# Altium schematic sheet 1GB DDR3L Modules.SchDoc
size A3; SheetNumber: 8; SheetTotal: 11
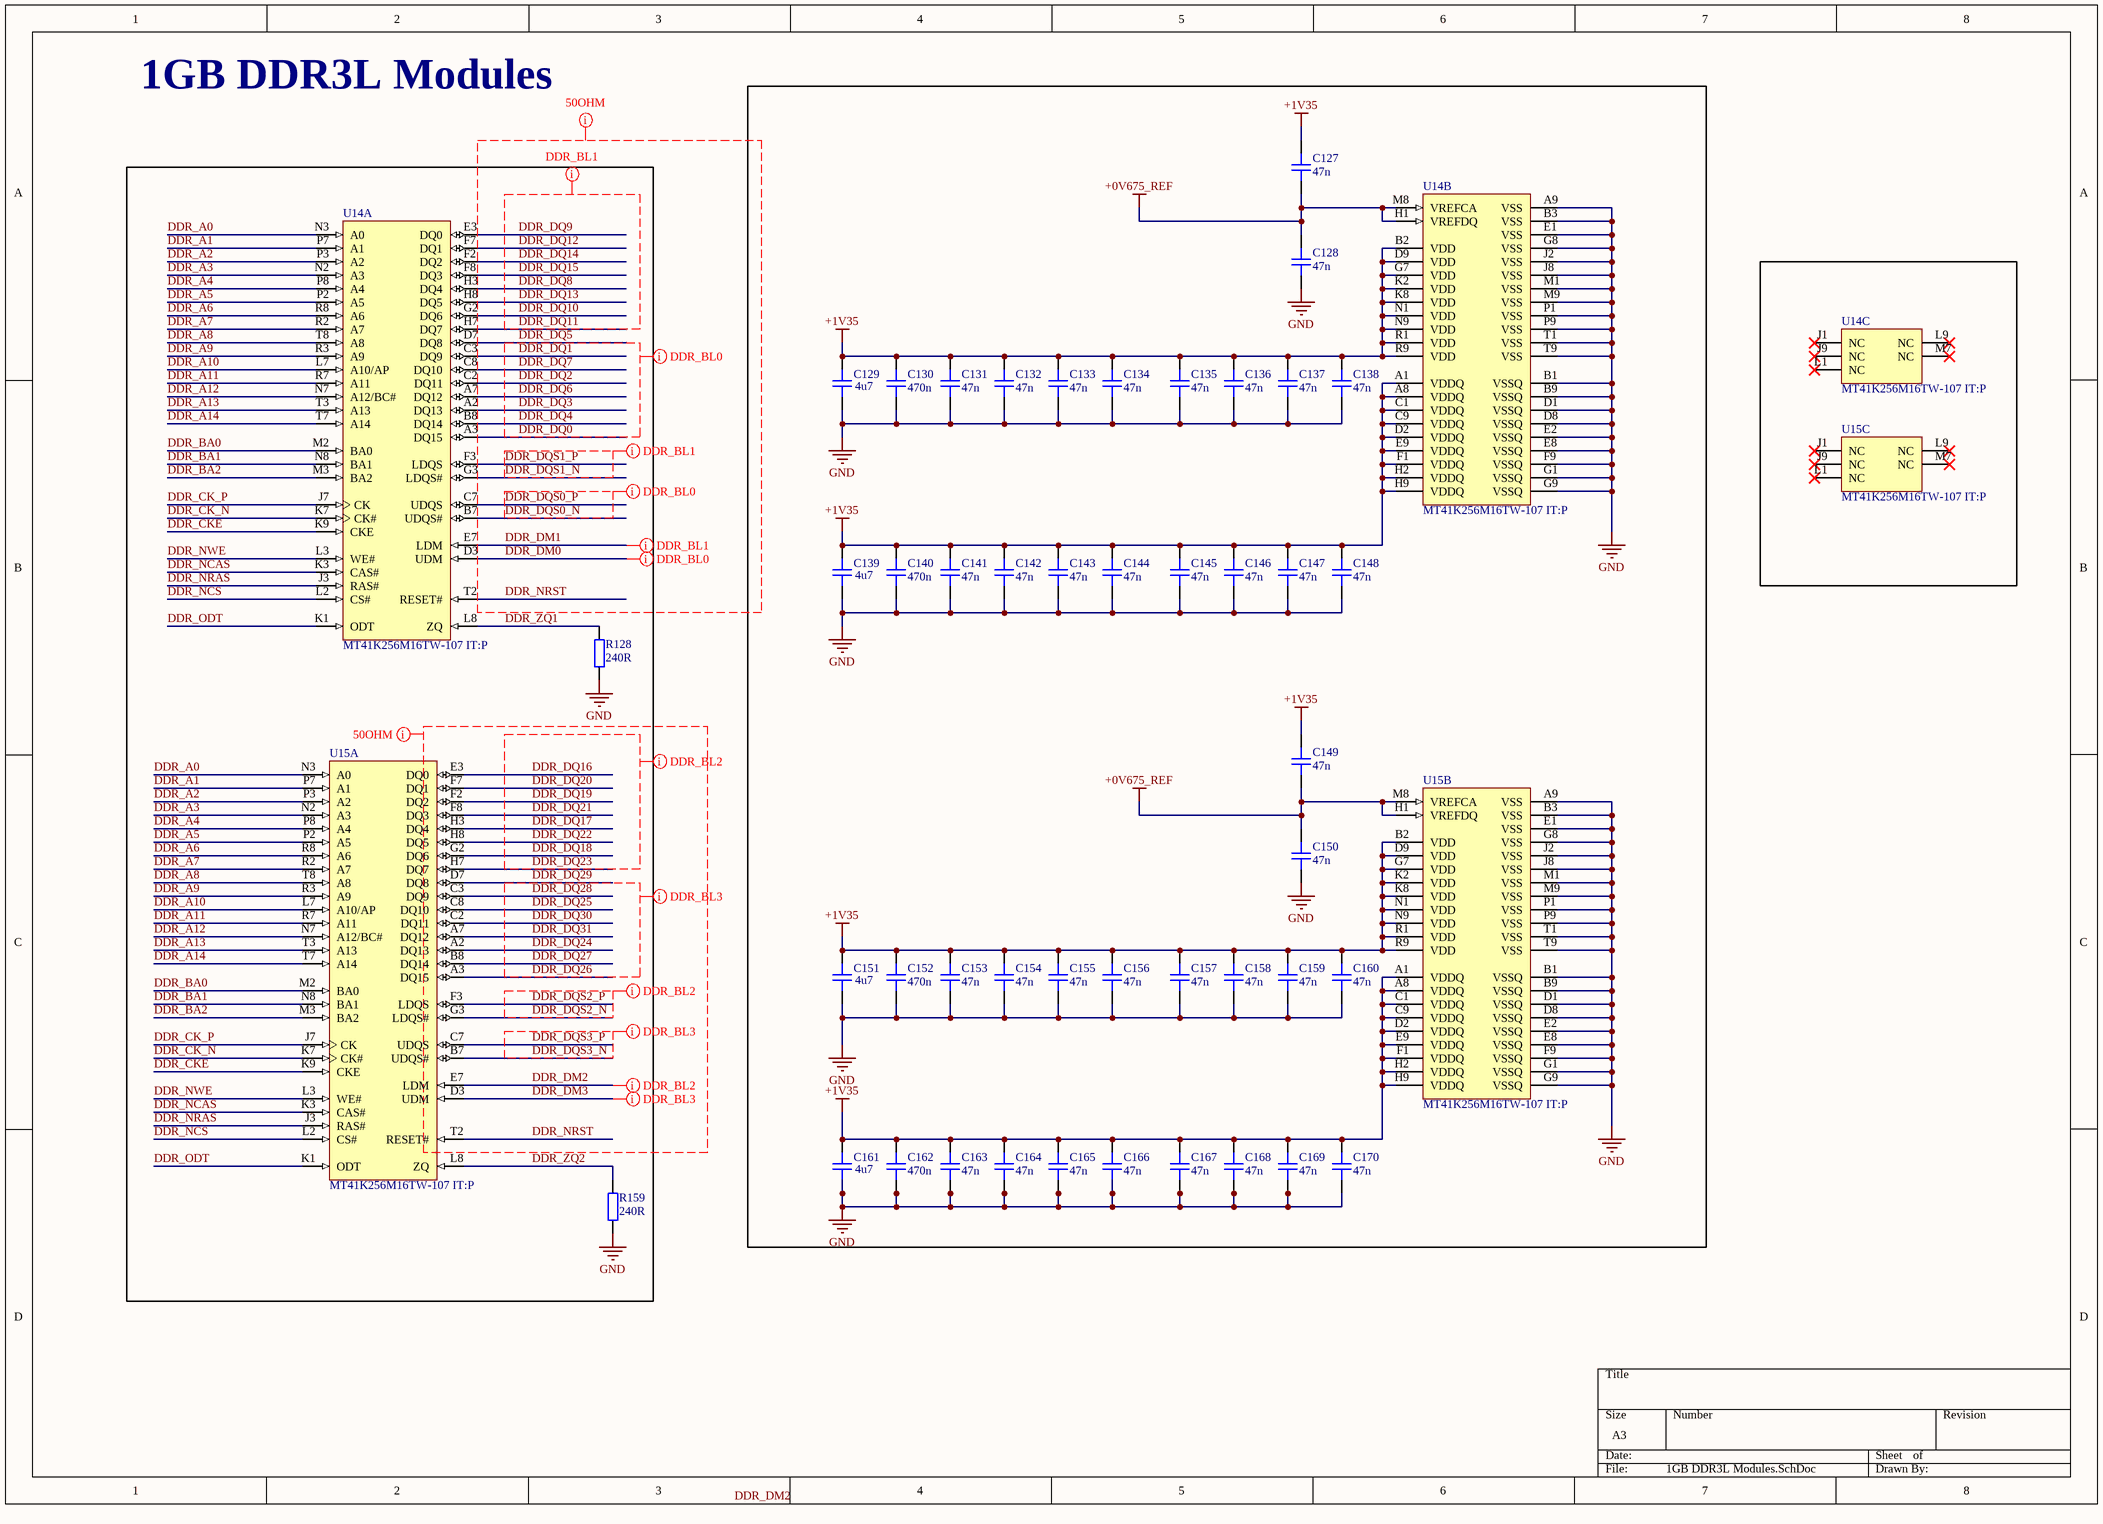
[diagram p0: 1GB DDR3L Modules.SchDoc]

## Parts
C127  value 47n  [CAP_0201]  (hidden comment: C0201)
C128  value 47n  [CAP_0201]  (hidden comment: C0201)
C129  value 4u7  [CAP_0402]  (hidden comment: C0402)
C130  value 470n  [CAP_0201]  (hidden comment: C0201)
C131  value 47n  [CAP_0201]  (hidden comment: C0201)
C132  value 47n  [CAP_0201]  (hidden comment: C0201)
C133  value 47n  [CAP_0201]  (hidden comment: C0201)
C134  value 47n  [CAP_0201]  (hidden comment: C0201)
C135  value 47n  [CAP_0201]  (hidden comment: C0201)
C136  value 47n  [CAP_0201]  (hidden comment: C0201)
C137  value 47n  [CAP_0201]  (hidden comment: C0201)
C138  value 47n  [CAP_0201]  (hidden comment: C0201)
C139  value 4u7  [CAP_0402]  (hidden comment: C0402)
C140  value 470n  [CAP_0201]  (hidden comment: C0201)
C141  value 47n  [CAP_0201]  (hidden comment: C0201)
C142  value 47n  [CAP_0201]  (hidden comment: C0201)
C143  value 47n  [CAP_0201]  (hidden comment: C0201)
C144  value 47n  [CAP_0201]  (hidden comment: C0201)
C145  value 47n  [CAP_0201]  (hidden comment: C0201)
C146  value 47n  [CAP_0201]  (hidden comment: C0201)
C147  value 47n  [CAP_0201]  (hidden comment: C0201)
C148  value 47n  [CAP_0201]  (hidden comment: C0201)
C149  value 47n  [CAP_0201]  (hidden comment: C0201)
C150  value 47n  [CAP_0201]  (hidden comment: C0201)
C151  value 4u7  [CAP_0402]  (hidden comment: C0402)
C152  value 470n  [CAP_0201]  (hidden comment: C0201)
C153  value 47n  [CAP_0201]  (hidden comment: C0201)
C154  value 47n  [CAP_0201]  (hidden comment: C0201)
C155  value 47n  [CAP_0201]  (hidden comment: C0201)
C156  value 47n  [CAP_0201]  (hidden comment: C0201)
C157  value 47n  [CAP_0201]  (hidden comment: C0201)
C158  value 47n  [CAP_0201]  (hidden comment: C0201)
C159  value 47n  [CAP_0201]  (hidden comment: C0201)
C160  value 47n  [CAP_0201]  (hidden comment: C0201)
C161  value 4u7  [CAP_0402]  (hidden comment: C0402)
C162  value 470n  [CAP_0201]  (hidden comment: C0201)
C163  value 47n  [CAP_0201]  (hidden comment: C0201)
C164  value 47n  [CAP_0201]  (hidden comment: C0201)
C165  value 47n  [CAP_0201]  (hidden comment: C0201)
C166  value 47n  [CAP_0201]  (hidden comment: C0201)
C167  value 47n  [CAP_0201]  (hidden comment: C0201)
C168  value 47n  [CAP_0201]  (hidden comment: C0201)
C169  value 47n  [CAP_0201]  (hidden comment: C0201)
C170  value 47n  [CAP_0201]  (hidden comment: C0201)
R128  value 240R  [RES_0402]  (hidden comment: R0402)
R159  value 240R  [RES_0402]  (hidden comment: R0402)
U14  MT41K256M16TW-107 IT:P  [MICT-TW-96]  (parts A,B,C of 3)
U15  MT41K256M16TW-107 IT:P  [MICT-TW-96]  (parts A,B,C of 3)

## Nets
+0V675_REF: C127.1 C128.2 C149.1 C150.2 U14.H1(VREFDQ) U14.M8(VREFCA) U15.H1(VREFDQ) U15.M8(VREFCA)
+1V35: C127.2 C129.2 C130.2 C131.2 C132.2 C133.2 C134.2 C135.2 C136.2 C137.2 C138.2 C139.2 C140.2 C141.2 C142.2 C143.2 C144.2 C145.2 C146.2 C147.2 C148.2 C149.2 C151.2 C152.2 C153.2 C154.2 C155.2 C156.2 C157.2 C158.2 C159.2 C160.2 C161.2 C162.2 C163.2 C164.2 C165.2 C166.2 C167.2 C168.2 C169.2 C170.2 U14.A1(VDDQ) U14.A8(VDDQ) U14.B2(VDD) U14.C1(VDDQ) U14.C9(VDDQ) U14.D2(VDDQ) U14.D9(VDD) U14.E9(VDDQ) U14.F1(VDDQ) U14.G7(VDD) U14.H2(VDDQ) U14.H9(VDDQ) U14.K2(VDD) U14.K8(VDD) U14.N1(VDD) U14.N9(VDD) U14.R1(VDD) U14.R9(VDD) U15.A1(VDDQ) U15.A8(VDDQ) U15.B2(VDD) U15.C1(VDDQ) U15.C9(VDDQ) U15.D2(VDDQ) U15.D9(VDD) U15.E9(VDDQ) U15.F1(VDDQ) U15.G7(VDD) U15.H2(VDDQ) U15.H9(VDDQ) U15.K2(VDD) U15.K8(VDD) U15.N1(VDD) U15.N9(VDD) U15.R1(VDD) U15.R9(VDD)
GND: C128.1 C129.1 C130.1 C131.1 C132.1 C133.1 C134.1 C135.1 C136.1 C137.1 C138.1 C139.1 C140.1 C141.1 C142.1 C143.1 C144.1 C145.1 C146.1 C147.1 C148.1 C150.1 C151.1 C152.1 C153.1 C154.1 C155.1 C156.1 C157.1 C158.1 C159.1 C160.1 C161.1 C162.1 C163.1 C164.1 C165.1 C166.1 C167.1 C168.1 C169.1 C170.1 R128.2 R159.2 U14.A9(VSS) U14.B1(VSSQ) U14.B3(VSS) U14.B9(VSSQ) U14.D1(VSSQ) U14.D8(VSSQ) U14.E1(VSS) U14.E2(VSSQ) U14.E8(VSSQ) U14.F9(VSSQ) U14.G1(VSSQ) U14.G8(VSS) U14.G9(VSSQ) U14.J2(VSS) U14.J8(VSS) U14.M1(VSS) U14.M9(VSS) U14.P1(VSS) U14.P9(VSS) U14.T1(VSS) U14.T9(VSS) U15.A9(VSS) U15.B1(VSSQ) U15.B3(VSS) U15.B9(VSSQ) U15.D1(VSSQ) U15.D8(VSSQ) U15.E1(VSS) U15.E2(VSSQ) U15.E8(VSSQ) U15.F9(VSSQ) U15.G1(VSSQ) U15.G8(VSS) U15.G9(VSSQ) U15.J2(VSS) U15.J8(VSS) U15.M1(VSS) U15.M9(VSS) U15.P1(VSS) U15.P9(VSS) U15.T1(VSS) U15.T9(VSS)
DDR_A0: U14.N3(A0) U15.N3(A0)
DDR_A1: U14.P7(A1) U15.P7(A1)
DDR_A2: U14.P3(A2) U15.P3(A2)
DDR_A3: U14.N2(A3) U15.N2(A3)
DDR_A4: U14.P8(A4) U15.P8(A4)
DDR_A5: U14.P2(A5) U15.P2(A5)
DDR_A6: U14.R8(A6) U15.R8(A6)
DDR_A7: U14.R2(A7) U15.R2(A7)
DDR_A8: U14.T8(A8) U15.T8(A8)
DDR_A9: U14.R3(A9) U15.R3(A9)
DDR_A10: U14.L7(A10/AP) U15.L7(A10/AP)
DDR_A11: U14.R7(A11) U15.R7(A11)
DDR_A12: U14.N7(A12/BC#) U15.N7(A12/BC#)
DDR_A13: U14.T3(A13) U15.T3(A13)
DDR_A14: U14.T7(A14) U15.T7(A14)
DDR_BA0: U14.M2(BA0) U15.M2(BA0)
DDR_BA1: U14.N8(BA1) U15.N8(BA1)
DDR_BA2: U14.M3(BA2) U15.M3(BA2)
DDR_CK_N: U14.K7(CK#) U15.K7(CK#)
DDR_CK_P: U14.J7(CK) U15.J7(CK)
DDR_CKE: U14.K9(CKE) U15.K9(CKE)
DDR_DM0: U14.D3(UDM)
DDR_DM1: U14.E7(LDM)
DDR_DM2: U15.E7(LDM)
DDR_DM3: U15.D3(UDM)
DDR_DQ0: U14.A3(DQ15)
DDR_DQ1: U14.C3(DQ9)
DDR_DQ2: U14.C2(DQ11)
DDR_DQ3: U14.A2(DQ13)
DDR_DQ4: U14.B8(DQ14)
DDR_DQ5: U14.D7(DQ8)
DDR_DQ6: U14.A7(DQ12)
DDR_DQ7: U14.C8(DQ10)
DDR_DQ8: U14.H3(DQ4)
DDR_DQ9: U14.E3(DQ0)
DDR_DQ10: U14.G2(DQ6)
DDR_DQ11: U14.H7(DQ7)
DDR_DQ12: U14.F7(DQ1)
DDR_DQ13: U14.H8(DQ5)
DDR_DQ14: U14.F2(DQ2)
DDR_DQ15: U14.F8(DQ3)
DDR_DQ16: U15.E3(DQ0)
DDR_DQ17: U15.H3(DQ4)
DDR_DQ18: U15.G2(DQ6)
DDR_DQ19: U15.F2(DQ2)
DDR_DQ20: U15.F7(DQ1)
DDR_DQ21: U15.F8(DQ3)
DDR_DQ22: U15.H8(DQ5)
DDR_DQ23: U15.H7(DQ7)
DDR_DQ24: U15.A2(DQ13)
DDR_DQ25: U15.C8(DQ10)
DDR_DQ26: U15.A3(DQ15)
DDR_DQ27: U15.B8(DQ14)
DDR_DQ28: U15.C3(DQ9)
DDR_DQ29: U15.D7(DQ8)
DDR_DQ30: U15.C2(DQ11)
DDR_DQ31: U15.A7(DQ12)
DDR_DQS0_N: U14.B7(UDQS#)
DDR_DQS0_P: U14.C7(UDQS)
DDR_DQS1_N: U14.G3(LDQS#)
DDR_DQS1_P: U14.F3(LDQS)
DDR_DQS2_N: U15.G3(LDQS#)
DDR_DQS2_P: U15.F3(LDQS)
DDR_DQS3_N: U15.B7(UDQS#)
DDR_DQS3_P: U15.C7(UDQS)
DDR_NCAS: U14.K3(CAS#) U15.K3(CAS#)
DDR_NCS: U14.L2(CS#) U15.L2(CS#)
DDR_NRAS: U14.J3(RAS#) U15.J3(RAS#)
DDR_NRST: U14.T2(RESET#) U15.T2(RESET#)
DDR_NWE: U14.L3(WE#) U15.L3(WE#)
DDR_ODT: U14.K1(ODT) U15.K1(ODT)
DDR_ZQ1: R128.1 U14.L8(ZQ)
DDR_ZQ2: R159.1 U15.L8(ZQ)

Not connected (* = marked no-connect by the designer): U14 J1(NC)* J9(NC)* L1(NC)* L9(NC)* M7(NC)*; U15 J1(NC)* J9(NC)* L1(NC)* L9(NC)* M7(NC)*

## Layout directives
net class DDR_BL1: DDR_DM1, DDR_DQ8, DDR_DQ9, DDR_DQ10, DDR_DQ11, DDR_DQ12, DDR_DQ13, DDR_DQ14, DDR_DQ15, DDR_DQS1_N, DDR_DQS1_P
net class DDR_BL0: DDR_DM0, DDR_DQ0, DDR_DQ1, DDR_DQ2, DDR_DQ3, DDR_DQ4, DDR_DQ5, DDR_DQ6, DDR_DQ7, DDR_DQS0_N, DDR_DQS0_P
net class DDR_BL2: DDR_DM2, DDR_DQ16, DDR_DQ17, DDR_DQ18, DDR_DQ19, DDR_DQ20, DDR_DQ21, DDR_DQ22, DDR_DQ23, DDR_DQS2_N, DDR_DQS2_P
net class DDR_BL3: DDR_DM3, DDR_DQ24, DDR_DQ25, DDR_DQ26, DDR_DQ27, DDR_DQ28, DDR_DQ29, DDR_DQ30, DDR_DQ31, DDR_DQS3_N, DDR_DQS3_P
net class 50OHM: DDR_DM0, DDR_DM1, DDR_DM2, DDR_DM3, DDR_DQ0, DDR_DQ1, DDR_DQ2, DDR_DQ3, DDR_DQ4, DDR_DQ5, DDR_DQ6, DDR_DQ7, DDR_DQ8, DDR_DQ9, DDR_DQ10, DDR_DQ11, DDR_DQ12, DDR_DQ13, DDR_DQ14, DDR_DQ15, DDR_DQ16, DDR_DQ17, DDR_DQ18, DDR_DQ19, DDR_DQ20, DDR_DQ21, DDR_DQ22, DDR_DQ23, DDR_DQ24, DDR_DQ25, DDR_DQ26, DDR_DQ27, DDR_DQ28, DDR_DQ29, DDR_DQ30, DDR_DQ31, DDR_DQS0_N, DDR_DQS0_P, DDR_DQS1_N, DDR_DQS1_P, DDR_DQS2_N, DDR_DQS2_P, DDR_DQS3_N, DDR_DQS3_P, DDR_NRST

## Notes on the sheet
- 1GB DDR3L Modules
- Labels drawn without touching a wire or pin: DDR_DM2

## Library data of the parts
C127 C128 C130-C138 C140-C150 C152-C160 C162-C170 = CAP_0201: Capacitor SMD 0201; Rating: 16V; Manufacturer: *; Manufacturer Part Number: *; Distributor Link: *; LCSC: *; Dielectric: *
C129 C139 C151 C161 = CAP_0402: Capacitor SMD 0402; Manufacturer: *; Manufacturer Part Number: *; Distributor Link: *; LCSC: *; Rating: *; Dielectric: *
R128 R159 = RES_0402: Resistor SMD 0402; Manufacturer: *; Manufacturer Part Number: *; Distributor Link: *; LCSC: *
U14 U15 = CMP-2000-06773-2: Automotive DDR3L SDRAM, 4 GB, 933 MHz, 1.283 to 1.45 V, -40 to 95 degC, 96-Pin TFBGA, RoHS, Tray; Manufacturer: Micron; Data Bus Width: 16b; Address Bus Width: 15b; Operating Supply Voltage: 1.35V; Access Time: 1.07ns; Max Frequency: 933MHz; Density: 4Gb; Package Reference: TW-96; Max Operating Temperature: 95degC; RoHSCompliant: true; Datasheet Version: Rev. D, 02/2017; Datasheet URL: https://www.micron.com/~/media/documents/products/data-sheet/dram/ddr3/4gb_automotive_ddr3l.pdf; Mount: SurfaceMount; Min Operating Temperature: -40degC; Package Description: 96-Ball Fine Pitch Ball Grid Array, Body 14 x 8 mm, Pitch 0.8 mm; Mounting Technology: SurfaceMount; Contact Plating: Silver; Manufacturer URL: http://www.micron.com/